# Altium project iTimeAfrica.PrjPcb
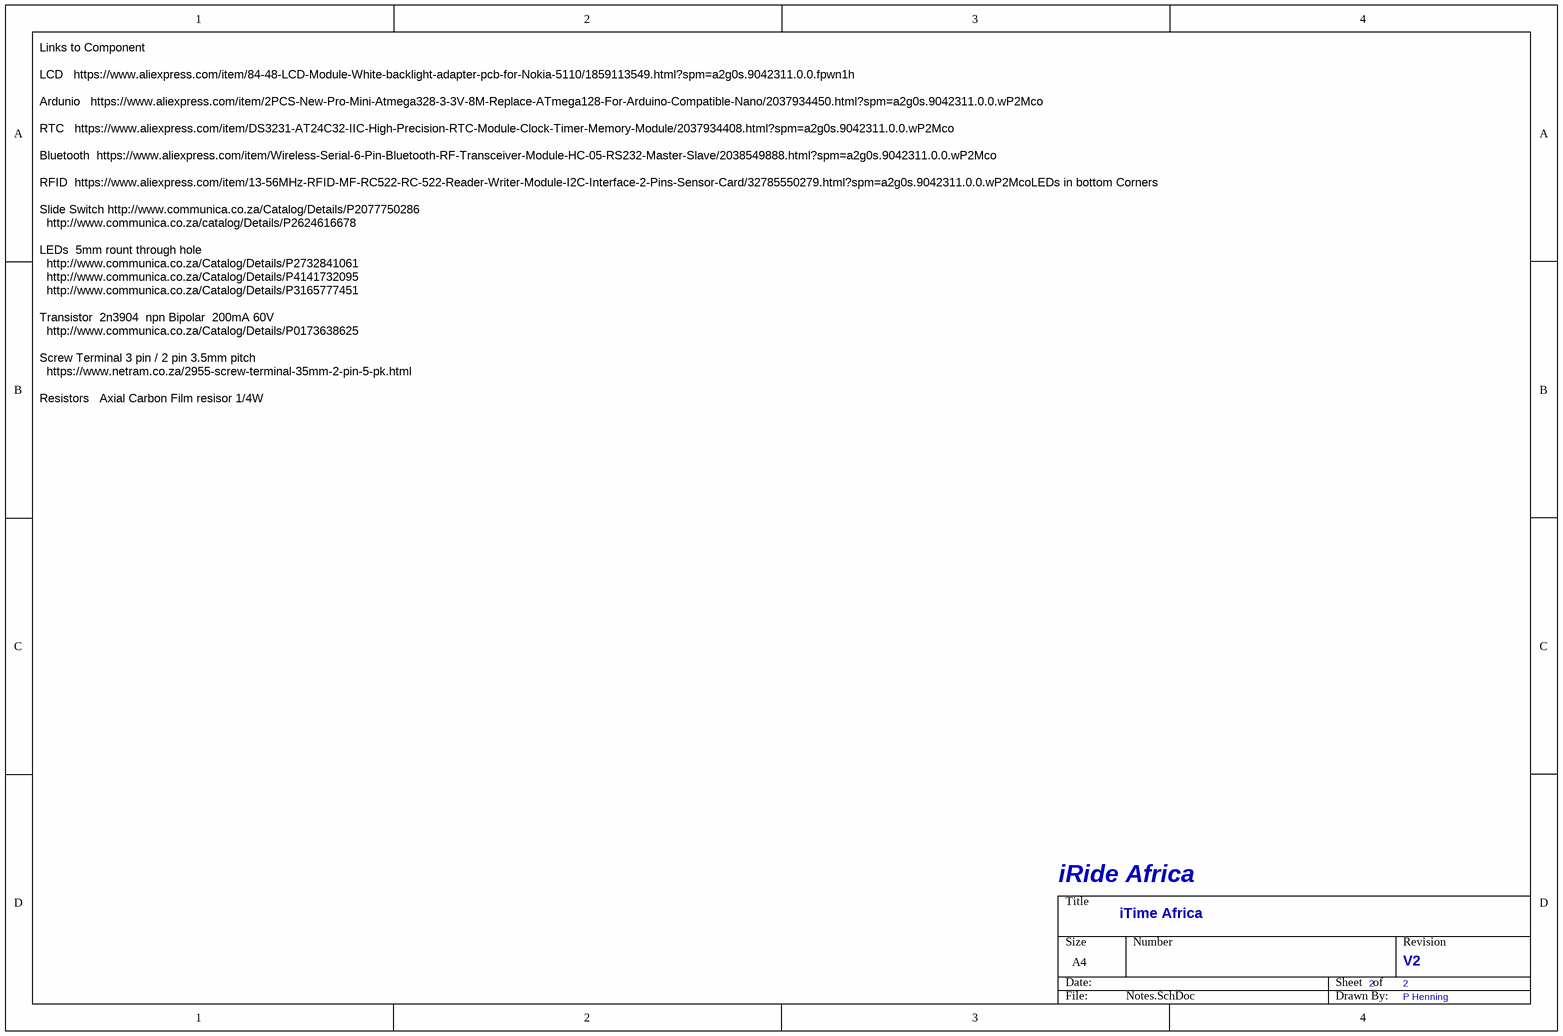
[diagram p0: Notes.SchDoc]
2 sheets, 39 parts. Net scope: global (net labels, ports and power ports of the same name join across sheets).
Board file: ITA_v2.PcbDoc
Sheets:
  Notes.SchDoc
  iTimeAfrica.SchDoc

## Sheet Notes.SchDoc
size A4; DocumentNumber: 2; SheetNumber: 2; SheetTotal: 2

### Notes on the sheet
- Links to Component
  LCD 		https://www.aliexpress.com/item/84-48-LCD-Module-White-backlight-adapter-pcb-for-Nokia-5110/1859113549.html?spm=a2g0s.9042311.0.0.fpwn1h
  Ardunio 		https://www.aliexpress.com/item/2PCS-New-Pro-Mini-Atmega328-3-3V-8M-Replace-ATmega128-For-Arduino-Compatible-Nano/2037934450.html?spm=a2g0s.9042311.0.0.wP2Mco
  RTC 		https://www.aliexpress.com/item/DS3231-AT24C32-IIC-High-Precision-RTC-Module-Clock-Timer-Memory-Module/2037934408.html?spm=a2g0s.9042311.0.0.wP2Mco
  Bluetooth		https://www.aliexpress.com/item/Wireless-Serial-6-Pin-Bluetooth-RF-Transceiver-Module-HC-05-RS232-Master-Slave/2038549888.html?spm=a2g0s.9042311.0.0.wP2Mco
  RFID		https://www.aliexpress.com/item/13-56MHz-RFID-MF-RC522-RC-522-Reader-Writer-Module-I2C-Interface-2-Pins-Sensor-Card/32785550279.html?spm=a2g0s.9042311.0.0.wP2McoLEDs in bottom Corners
  Slide Switch	http://www.communica.co.za/Catalog/Details/P2077750286
  http://www.communica.co.za/catalog/Details/P2624616678
  LEDs		5mm rount through hole
  http://www.communica.co.za/Catalog/Details/P2732841061
  http://www.communica.co.za/Catalog/Details/P4141732095
  http://www.communica.co.za/Catalog/Details/P3165777451
  Transistor		2n3904  npn Bipolar  200mA 60V
  http://www.communica.co.za/Catalog/Details/P0173638625
  Screw Terminal	3 pin / 2 pin 3.5mm pitch
  https://www.netram.co.za/2955-screw-terminal-35mm-2-pin-5-pk.html
  Resistors  	Axial Carbon Film resisor 1/4W
- iRide Africa
- iTime Africa
- 2
- V2
- P Henning

## Sheet iTimeAfrica.SchDoc
size A3; DocumentNumber: 1; SheetNumber: 1; SheetTotal: 2
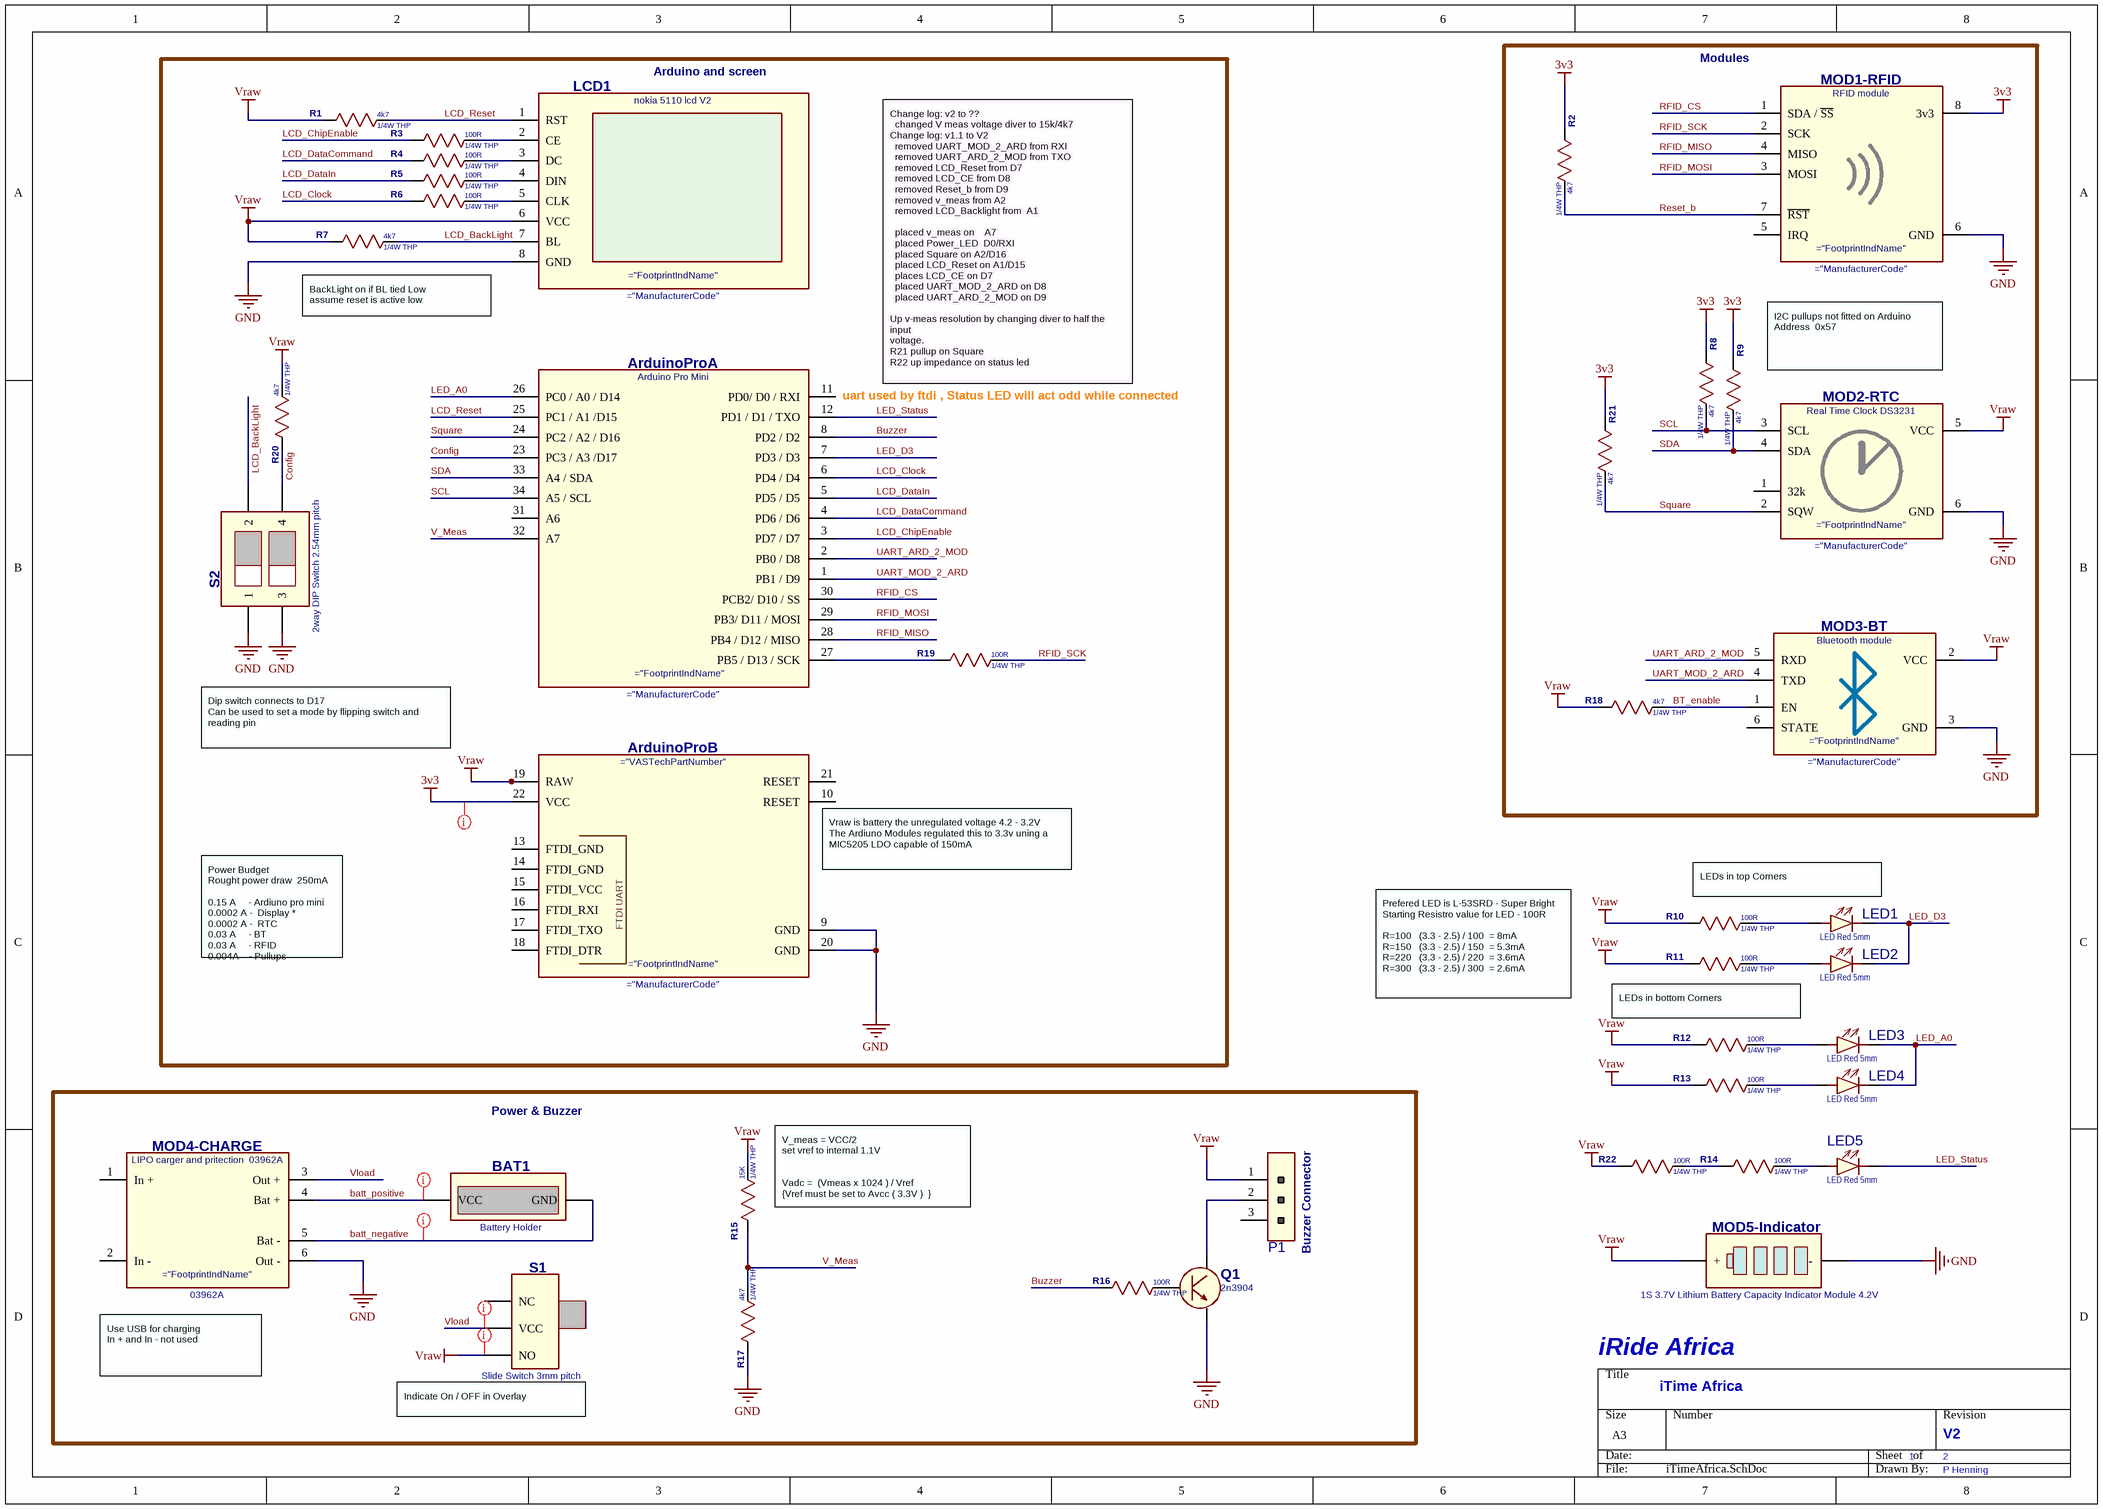
[diagram p1: iTimeAfrica.SchDoc]

### Parts
ArduinoPro  Arduino Pro Mini  [ARDUINO PRO MINI v2 (NO FTDI)]  (value not drawn)  (parts A,B of 2)
BAT1  Battery Holder  [Battery Holder]  (value not drawn)
LCD1  nokia 5110 lcd  [Nokia 5110 GLCD 84x48]  (value not drawn)
LED1  LED Red 5mm  [LED THL 5x9mm Vert]
LED2  LED Red 5mm  [LED THL 5x9mm Vert]
LED3  LED Red 5mm  [LED THL 5x9mm Vert]
LED4  LED Red 5mm  [LED THL 5x9mm Vert]
LED5  LED Red 5mm  [LED THL 5x9mm Vert]
MOD1-RFID  RFID module  [RFID-RC522 (2 MH)]  (value not drawn)
MOD2-RTC  Real Time Clock DS3231  [RTC DS3231 (2 MH)]  (value not drawn)
MOD3-BT  Bluetooth module  [BlueTooth Card]  (value not drawn)
MOD4-CHARGE  Real Time Clock DS3231  [Charger/protection]  (value not drawn)
MOD5-Indicator  1S 3.7V Lithium Battery Capacity Indicator Module 4.2V  [Battery Indicator  single mouning hole]  (value not drawn)
P1  3 pin Screw Terminal 3.5mm  [3x1 Screw terminal 3.5mm]  (value not drawn)
Q1  2n3904  [TO-92]
R1  Package: 1/4W THP  [Res 1/4W THP (4k7)]  (hidden comment: 4k7)
R2  Package: 1/4W THP  [Res 1/4W THP (4k7)]  (hidden comment: 4k7)
R3  Package: 1/4W THP  [Res 1/4W THP (100R)]  (hidden comment: 100R)
R4  Package: 1/4W THP  [Res 1/4W THP (100R)]  (hidden comment: 100R)
R5  Package: 1/4W THP  [Res 1/4W THP (100R)]  (hidden comment: 100R)
R6  Package: 1/4W THP  [Res 1/4W THP (100R)]  (hidden comment: 100R)
R7  Package: 1/4W THP  [Res 1/4W THP (4k7)]  (hidden comment: 4k7)
R8  Package: 1/4W THP  [Res 1/4W THP (4k7)]  (hidden comment: 4k7)
R9  Package: 1/4W THP  [Res 1/4W THP (4k7)]  (hidden comment: 4k7)
R10  Package: 1/4W THP  [Res 1/4W THP (100R)]  (hidden comment: 100R)
R11  Package: 1/4W THP  [Res 1/4W THP (100R)]  (hidden comment: 100R)
R12  Package: 1/4W THP  [Res 1/4W THP (100R)]  (hidden comment: 100R)
R13  Package: 1/4W THP  [Res 1/4W THP (100R)]  (hidden comment: 100R)
R14  Package: 1/4W THP  [Res 1/4W THP (100R)]  (hidden comment: 100R)
R15  Package: 1/4W THP  [Res 1/4W THP]  (hidden comment: 15K)
R16  Package: 1/4W THP  [Res 1/4W THP (100R)]  (hidden comment: 100R)
R17  Package: 1/4W THP  [Res 1/4W THP (4k7)]  (hidden comment: 4k7)
R18  Package: 1/4W THP  [Res 1/4W THP (4k7)]  (hidden comment: 4k7)
R19  Package: 1/4W THP  [Res 1/4W THP (100R)]  (hidden comment: 100R)
R20  Package: 1/4W THP  [Res 1/4W THP (4k7)]  (hidden comment: 4k7)
R21  Package: 1/4W THP  [Res 1/4W THP (4k7)]  (hidden comment: 4k7)
R22  Package: 1/4W THP  [Res 1/4W THP (100R)]  (hidden comment: 100R)
S1  Slide Switch 3mm pitch  [Slide Switch 3mm]  (value not drawn)
S2  2x DIP Switch 2.54mm pitch  [2way DIP switch]  (value not drawn)

### Blocks framed on the sheet
Modules: MOD1-RFID MOD2-RTC MOD3-BT R2 R8 R9 R18 R21

### Nets
3v3: ArduinoPro.22(VCC) MOD1-RFID.8(3v3) R2.1 R8.1 R9.1 R21.1
GND: ArduinoPro.9(GND) ArduinoPro.20(GND) LCD1.8(GND) MOD1-RFID.6(GND) MOD2-RTC.6(GND) MOD3-BT.3(GND) MOD4-CHARGE.6(Out_-) MOD5-Indicator.2(-) Q1.3(E) R17.1 S2.1 S2.3
Vraw: ArduinoPro.19(RAW) LCD1.6(VCC) MOD2-RTC.5(VCC) MOD3-BT.2(VCC) MOD5-Indicator.1(+) P1.1 R1.1 R7.1 R10.1 R11.1 R12.1 R13.1 R15.2 R18.1 R20.2 R22.1 S1.3(NO)
batt_negative: BAT1.2(GND) MOD4-CHARGE.5(Bat_-)
batt_positive: BAT1.1(VCC) MOD4-CHARGE.4(Bat_+)
BT_enable: MOD3-BT.1(EN) R18.2
Buzzer: ArduinoPro.8(PD2_/_D2) R16.1
Config: ArduinoPro.23(PC3_/_A3_/D17) R20.1 S2.4
LCD_BackLight: LCD1.7(BL) R7.2 S2.2
LCD_ChipEnable: ArduinoPro.3(PD7_/_D7) R3.1
LCD_Clock: ArduinoPro.6(PD4_/_D4) R6.1
LCD_DataCommand: ArduinoPro.4(PD6_/_D6) R4.1
LCD_DataIn: ArduinoPro.5(PD5_/_D5) R5.1
LCD_Reset: ArduinoPro.25(PC1_/_A1_/D15) LCD1.1(RST) R1.2
LED_A0: ArduinoPro.26(PC0_/_A0_/_D14) LED3.2(C) LED4.2(C)
LED_D3: ArduinoPro.7(PD3_/_D3) LED1.2(C) LED2.2(C)
LED_Status: ArduinoPro.12(PD1_/_D1_/_TXO) LED5.2(C)
Reset_b: MOD1-RFID.7(~{RST}) R2.2
RFID_CS: ArduinoPro.30(PCB2/_D10_/_SS) MOD1-RFID.1(SDA_/_~{SS})
RFID_MISO: ArduinoPro.28(PB4_/_D12_/_MISO) MOD1-RFID.4(MISO)
RFID_MOSI: ArduinoPro.29(PB3/_D11_/_MOSI) MOD1-RFID.3(MOSI)
RFID_SCK: MOD1-RFID.2(SCK) R19.2
SCL: ArduinoPro.34(A5_/_SCL) MOD2-RTC.3(SCL) R8.2
SDA: ArduinoPro.33(A4_/_SDA) MOD2-RTC.4(SDA) R9.2
Square: ArduinoPro.24(PC2_/_A2_/_D16) MOD2-RTC.2(SQW) R21.2
UART_ARD_2_MOD: ArduinoPro.2(PB0_/_D8) MOD3-BT.5(RXD)
UART_MOD_2_ARD: ArduinoPro.1(PB1_/_D9) MOD3-BT.4(TXD)
V_Meas: ArduinoPro.32(A7) R15.1 R17.2
Vload: MOD4-CHARGE.3(Out_+) S1.2(VCC)
NetArduinoPro_27: ArduinoPro.27(PB5_/_D13_/_SCK) R19.1
NetLCD1_2: LCD1.2(CE) R3.2
NetLCD1_3: LCD1.3(DC) R4.2
NetLCD1_4: LCD1.4(DIN) R5.2
NetLCD1_5: LCD1.5(CLK) R6.2
NetLED1_1: LED1.1(A) R10.2
NetLED2_1: LED2.1(A) R11.2
NetLED3_1: LED3.1(A) R12.2
NetLED4_1: LED4.1(A) R13.2
NetLED5_1: LED5.1(A) R14.2
NetP1_2: P1.2 Q1.1(C)
NetQ1_2: Q1.2(B) R16.2
NetR14_1: R14.1 R22.2

Not connected (* = marked no-connect by the designer): ArduinoPro 10(RESET) 11(PD0/_D0_/_RXI) 13(FTDI_GND) 14(FTDI_GND) 15(FTDI_VCC) 16(FTDI_RXI) 17(FTDI_TXO) 18(FTDI_DTR) 21(RESET) 31(A6); MOD1-RFID 5(IRQ); MOD2-RTC 1(32k); MOD3-BT 6(STATE); MOD4-CHARGE 1(In_+) 2(In_-); P1 3; S1 1(NC)

### Layout directives
net class Power: 3v3, batt_negative, batt_positive, Vload, Vraw

### Notes on the sheet
- Arduino and screen
- BackLight on if BL tied Low
  assume reset is active low
- Change log: v2 to ??
  changed V meas voltage diver to 15k/4k7
  Change log: v1.1 to V2
  removed UART_MOD_2_ARD from RXI
  removed UART_ARD_2_MOD from TXO
  removed LCD_Reset from D7
  removed LCD_CE from D8
  removed Reset_b from D9
  removed v_meas from A2
  removed LCD_Backlight from  A1
  placed v_meas on    A7
  placed Power_LED  D0/RXI
  placed Square on A2/D16
  placed LCD_Reset on A1/D15
  places LCD_CE on D7
  placed UART_MOD_2_ARD on D8
  placed UART_ARD_2_MOD on D9
  Up v-meas resolution by changing diver to half the input
  voltage.
  R21 pullup on Square
  R22 up impedance on status led
- (near R9) I2C pullups not fitted on Arduino
  Address  0x57
- (near ArduinoPro) uart used by ftdi , Status LED will act odd while connected
- Dip switch connects to D17
  Can be used to set a mode by flipping switch and reading pin
- (near ArduinoPro) Vraw is battery the unregulated voltage 4.2 - 3.2V
  The Ardiuno Modules regulated this to 3.3v uning a MIC5205 LDO capable of 150mA
- LEDs in top Corners
- Power Budget
  Rought power draw  250mA
  0.15 A     - Ardiuno pro mini
  0.0002 A -  Display *
  0.0002 A -  RTC
  0.03 A     - BT
  0.03 A     - RFID
  0.004A    - Pullups
  0.04A      - LEDS
- Prefered LED is L-53SRD - Super Bright
  Starting Resistro value for LED - 100R
  R=100   (3.3 - 2.5) / 100  = 8mA
  R=150   (3.3 - 2.5) / 150  = 5.3mA
  R=220   (3.3 - 2.5) / 220  = 3.6mA
  R=300   (3.3 - 2.5) / 300  = 2.6mA
- LEDs in bottom Corners
- Power & Buzzer
- (near R15) V_meas = VCC/2
  set vref to internal 1.1V
  Vadc =  (Vmeas x 1024 ) / Vref
  {Vref must be set to Avcc ( 3.3V )  }
- (near P1) Buzzer Connector
- Use USB for charging
  In + and In - not used
- iRide Africa
- iTime Africa
- (near S1) Indicate On / OFF in Overlay
- 1
- V2
- 2
- P Henning
- (in symbol Arduino Pro Mini, part B) FTDI UART

### Library data of the parts
ArduinoPro = Arduino Pro Mini: Manufacturer: SparkFun Electronics; ManufacturerPartNumber: DEV-11113  (check this); Attributes: Arduino Pro Mini; Supplier_1: https://www.aliexpress.com/item/2PCS-New-Pro-Mini-Atmega328-3-3V-8M-Replace-ATmega128-For-Arduino-Compatible-Nano/2037934450.html?spm=a2g0s.9042311.0.0.wP2Mco
LCD1 = nokia 5110 lcd V2: Manufacturer: unknown; Attributes: nokia 5110 lcd; ManufacturerPartNumber: unknown; Supplier_1: https://www.aliexpress.com/item/84-48-LCD-Module-White-backlight-adapter-pcb-for-Nokia-5110/1859113549.html?spm=a2g0s.9042311.0.0.fpwn1h
LED1-LED5 = Red LED THP: Red LED, 5mm THP; ManufacturerPartNumber: L-53SR; Manufacturer: kingbright; Package: 5mm x9; Attributes: LED Red 5mm; Supplier_1: http://www.communica.co.za/Catalog/Details/P2732841061
MOD1-RFID = RFID module: ManufacturerPartNumber: RFID-RC533; Attributes: RFID module; Supplier_1: https://www.aliexpress.com/item/13-56MHz-RFID-MF-RC522-RC-522-Reader-Writer-Module-I2C-Interface-2-Pins-Sensor-Card/32785550279.html?spm=a2g0s.9042311.0.0.wP2Mco
MOD4-CHARGE = Charger / Protection: LIPO carger and pritection  03962A; Attributes: Real Time Clock DS3231; ManufacturerPartNumber: 03962A
MOD5-Indicator = Battery Indicator: Attributes: 1S 3.7V Lithium Battery Capacity Indicator Module 4.2V; Package: 45mm x 20mm; Supplier_2: ?; Supplier_1: AlliExpress
P1 = 3 pin Screw Terminal 3.5mm: ManufacturerPartNumber: 1984950; Manufacturer: RS; Attributes: 3 pin Screw Terminal 3.5mm; Package: 3x1 3.5mm; Supplier_1: https://www.netram.co.za/2955-screw-terminal-35mm-2-pin-5-pk.html
Q1 = NPN Transistor: Manufacturer: Fairchild; Supplier_1: http://www.communica.co.za/Catalog/Details/P0173638625; Attributes: 2n3904; ManufacturerPartNumber: 2n3904; Package: TO92
R1 R2 R7-R9 R17 R18 R20 R21 = 4k7: Resistor; Attributes: 4k7; Supplier_1: comunica
R3-R6 R10-R14 R16 R19 R22 = 100R: Resistor; Attributes: 100R; Supplier_1: comunica
R15 = 15K: Resistor; Attributes: 15K; Supplier_1: comunica
S1 = Slide Switch 3mm pitch: Manufacturer: Arcolectric Corporation; Attributes: Slide Switch 3mm pitch; Supplier_2: http://www.communica.co.za/catalog/Details/P2624616678; Supplier_1: http://www.communica.co.za/Catalog/Details/P2077750286; Package: 3x1 3mm
S2 = 2way DIP Switch 2.54mm pitch: Manufacturer: Arcolectric Corporation; ManufacturerPartNumber: KTS02E; Attributes: 2x DIP Switch 2.54mm pitch; Supplier_2: https://za.rs-online.com/web/p/dip-sip-switches/8772116/; Supplier_1: http://www.communica.co.za/Catalog/Details/P1597622190; Package: 2x2 2.54
BAT1 = Battery Holder: Attributes: Battery Holder; Supplier_2: ?; Supplier_1: AlliExpress
MOD2-RTC = Real Time Clock DS3231: Attributes: Real Time Clock DS3231; Supplier_1: https://www.aliexpress.com/item/DS3231-AT24C32-IIC-High-Precision-RTC-Module-Clock-Timer-Memory-Module/2037934408.html?spm=a2g0s.9042311.0.0.wP2Mco
MOD3-BT = Bluetooth module: Attributes: Bluetooth module; Supplier_1: https://www.aliexpress.com/item/Wireless-Serial-6-Pin-Bluetooth-RF-Transceiver-Module-HC-05-RS232-Master-Slave/2038549888.html?spm=a2g0s.9042311.0.0.wP2Mco